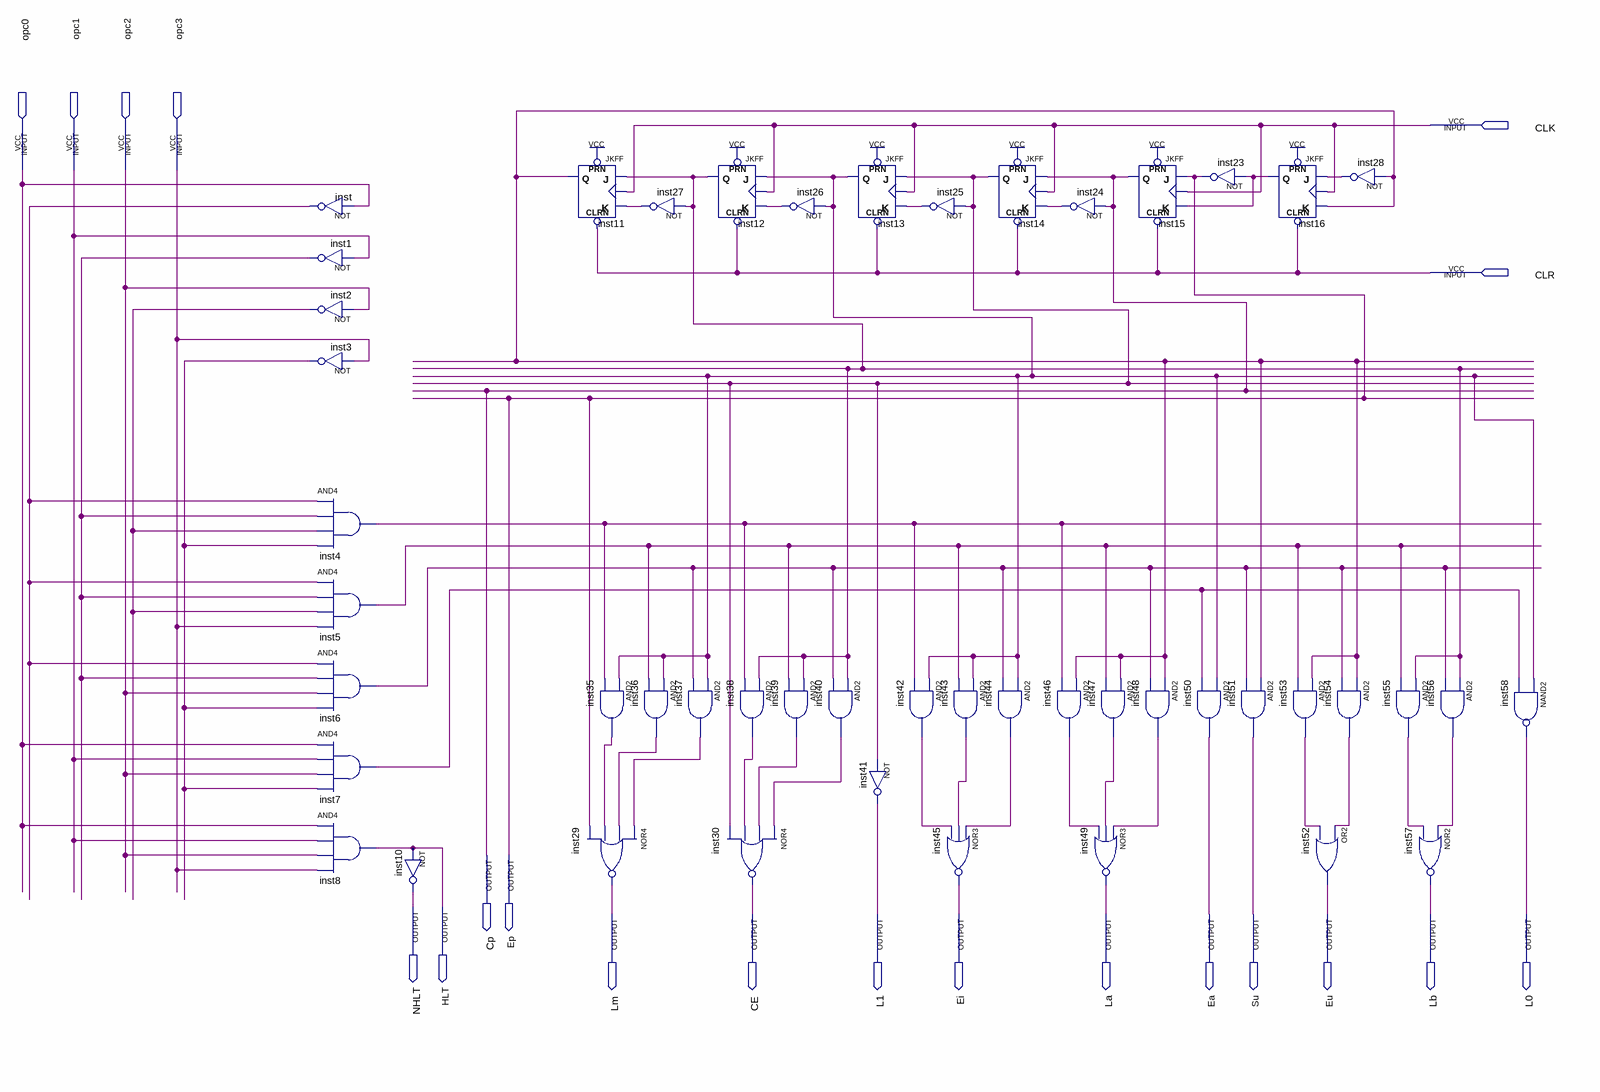
[diagram p0: schematic sheet]
// Quartus schematic control.bdf as structural Verilog: 48 symbols, 20 pins
module control (
  input  CLK,
  input  opc0,
  input  opc1,
  input  opc2,
  input  opc3,
  input  CLR,
  output Cp,
  output Ep,
  output NHLT,
  output HLT,
  output Lm,
  output CE,
  output L1,
  output Ei,
  output La,
  output Ea,
  output Su,
  output Eu,
  output Lb,
  output L0
);

  wire inst1_out, inst2_out, inst3_out, inst4_out, inst5_out, inst6_out, inst7_out, inst11_q, inst12_q,
       inst13_q, inst14_q, inst16_q, inst24_out, inst25_out, inst26_out, inst27_out, inst28_out, inst35_out,
       inst36_out, inst37_out, inst38_out, inst39_out, inst40_out, inst42_out, inst43_out, inst44_out,
       inst46_out, inst47_out, inst48_out, inst53_out, inst54_out, inst55_out, inst56_out, inst_out;

  not inst (inst_out, opc0);
  not inst1 (inst1_out, opc1);
  not inst2 (inst2_out, opc2);
  not inst3 (inst3_out, opc3);
  and inst4 (inst4_out, inst_out, inst1_out, inst2_out, inst3_out);
  and inst5 (inst5_out, inst_out, inst1_out, inst2_out, opc3);
  and inst6 (inst6_out, inst_out, inst1_out, opc2, inst3_out);
  and inst7 (inst7_out, opc0, opc1, opc2, inst3_out);
  and inst8 (HLT, opc0, opc1, opc2, opc3);
  not inst10 (NHLT, HLT);
  JKFF inst11 (.PRN(1'b1), .CLRN(CLR), .K(inst27_out), .J(inst12_q), .CLK(CLK), .Q(inst11_q));
  and inst35 (inst35_out, inst13_q, inst4_out);
  nor inst29 (Lm, inst37_out, inst36_out, inst35_out, Ep);
  not inst27 (inst27_out, inst12_q);
  and inst36 (inst36_out, inst13_q, inst5_out);
  JKFF inst12 (.PRN(1'b1), .CLRN(CLR), .K(inst26_out), .J(inst13_q), .CLK(CLK), .Q(inst12_q));
  and inst37 (inst37_out, inst13_q, inst6_out);
  nor inst30 (CE, inst40_out, inst39_out, inst38_out, inst14_q);
  and inst38 (inst38_out, inst12_q, inst4_out);
  and inst39 (inst39_out, inst12_q, inst5_out);
  not inst26 (inst26_out, inst13_q);
  and inst40 (inst40_out, inst12_q, inst6_out);
  JKFF inst13 (.PRN(1'b1), .CLRN(CLR), .K(inst25_out), .J(inst14_q), .CLK(CLK), .Q(inst13_q));
  not inst41 (L1, inst14_q);
  not inst25 (inst25_out, inst14_q);
  and inst42 (inst42_out, inst13_q, inst4_out);
  and inst43 (inst43_out, inst13_q, inst5_out);
  nor inst45 (Ei, inst44_out, inst43_out, inst42_out);
  JKFF inst14 (.PRN(1'b1), .CLRN(CLR), .K(inst24_out), .J(Cp), .CLK(CLK), .Q(inst14_q));
  and inst44 (inst44_out, inst13_q, inst6_out);
  not inst24 (inst24_out, Cp);
  and inst46 (inst46_out, inst11_q, inst4_out);
  JKFF inst15 (.PRN(1'b1), .CLRN(CLR), .K(inst16_q), .J(Ep), .CLK(CLK), .Q(Cp));
  and inst47 (inst47_out, inst11_q, inst5_out);
  nor inst49 (La, inst48_out, inst47_out, inst46_out);
  and inst48 (inst48_out, inst11_q, inst6_out);
  and inst50 (Ea, inst13_q, inst7_out);
  not inst23 (Ep, inst16_q);
  and inst51 (Su, inst11_q, inst6_out);
  JKFF inst16 (.PRN(1'b1), .CLRN(CLR), .K(inst11_q), .J(inst28_out), .CLK(CLK), .Q(inst16_q));
  and inst53 (inst53_out, inst11_q, inst5_out);
  or inst52 (Eu, inst54_out, inst53_out);
  not inst28 (inst28_out, inst11_q);
  and inst54 (inst54_out, inst11_q, inst6_out);
  and inst55 (inst55_out, inst12_q, inst5_out);
  nor inst57 (Lb, inst56_out, inst55_out);
  and inst56 (inst56_out, inst12_q, inst6_out);
  nand inst58 (L0, inst13_q, inst7_out);
endmodule
